# EAGLE design Breakout (EAGLE 9.4.2)
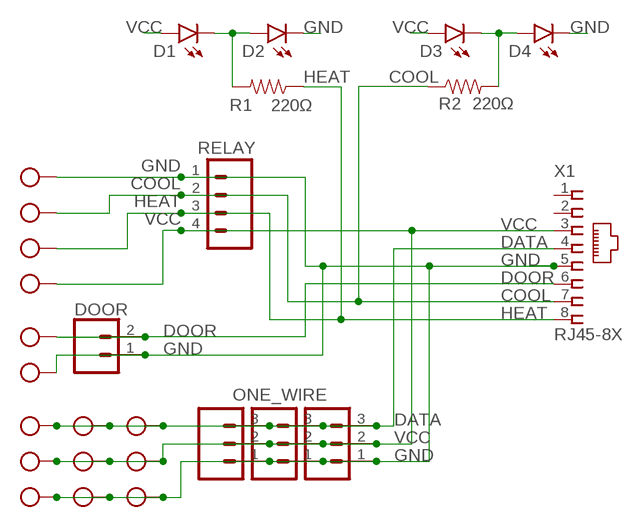
[diagram p0: schematic, sheet 1]

## Parts
D1  HINV  LED3MM  [LED_3MM]
D2  HNON  LED3MM  [LED_3MM]
D3  CINV  LED3MM  [LED_3MM]
D4  CNON  LED3MM  [LED_3MM]
DOOR  2-PIN  CONN_02  [1X02]
ONE_WIRE1  3-PIN  CONN_03  [1X03]
ONE_WIRE2  3-PIN  CONN_03  [1X03]
ONE_WIRE3  3-PIN  CONN_03  [1X03]
R1  220Ω  RESISTORAXIAL-0.3  [AXIAL-0.3]
R2  220Ω  RESISTORAXIAL-0.3  [AXIAL-0.3]
RELAY  4-PIN  CONN_04PTH  [1X04]
RELAY_TERM  4TERM  W237-4  [W237-4]
X1  RJ45-8X  [RJ45-NO-SHIELD]
X2  4TERM  W237-102  [W237-102]
X3  3TERM  W237-103  [W237-103]
X4  3TERM  W237-103  [W237-103]
X5  3TERM  W237-103  [W237-103]

## Nets
COOL: R2.P$1 RELAY.2 RELAY_TERM.2 X1.7
DATA: ONE_WIRE1.3 ONE_WIRE2.3 ONE_WIRE3.3 X1.4 X3.1 X4.1 X5.1
DOOR: DOOR.2 X1.6 X2.1
GND: D2.K(C) D4.K(C) DOOR.1 ONE_WIRE1.1 ONE_WIRE2.1 ONE_WIRE3.1 RELAY.1 RELAY_TERM.1 X1.5 X2.2 X3.3 X4.3 X5.3
HEAT: R1.P$1 RELAY.3 RELAY_TERM.3 X1.8
N$1: D1.K(C) D2.A R1.P$2
N$2: D3.K(C) D4.A R2.P$2
VCC: D1.A D3.A ONE_WIRE1.2 ONE_WIRE2.2 ONE_WIRE3.2 RELAY.4 RELAY_TERM.4 X1.3 X3.2 X4.2 X5.2
Unconnected: X1.1 X1.2

## Notes on the sheet
- ONE_WIRE

## Library data of the parts
D1-D4 = SparkFun-LED:LED: LED (Generic) Standard schematic elements and footprints for 5mm, 3mm, 1206, and 0603 sized LEDs. Generic LEDs with no color specified.; PROD_ID: DIO-08794
DOOR = SparkFun-Connectors:CONN_02: Multi connection point. Often used as Generic Header-pin footprint for 0.1 inch spaced/style header connections On any of the 0.1 inch spaced packages, you can populate with these: Break Away Headers - Straight <https://www.sparkfun.com/products/116> (PRT-00116) Break Away Male Headers - Right Angle <https://www.sparkfun.com/products/553> (PRT-00553) Female Headers <https://www.sparkfun.com/products/115> (PRT-00115) Break Away Headers - Machine Pin <https://www.sparkfun.com/products/117> (PRT-00117) Break Away Female Headers - Swiss Machine Pin <https://www.sparkfun.com/products/743> (PRT-00743) For SCREWTERMINALS and SPRING TERMINALS visit here: Screw Terimnals on SparkFun.com <https://www.sparkfun.com/search/results?term=Screw+Terminals> (5mm/3.5mm/2.54mm spacing) This device is also useful as a general connection point to wire up your design to another part of your project. Our various solder wires solder well into these plated through hole pads. Hook-Up Wire - Assortment (Stranded, 22 AWG) <https://www.sparkfun.com/products/11375> (PRT-11375) Hook-Up Wire - Assortment (Solid Core, 22 AWG) <https://www.sparkfun.com/products/11367> (PRT-11367) View the entire wire category on our website here <https://www.sparkfun.com/categories/141> Special notes: Molex polarized connector foot print use with: PRT-08233 with associated crimp pins and housings. 2.54_SCREWTERM for use with PRT-10571. 3.5mm Screw Terminal footprints for PRT-08084 5mm Screw Terminal footprints for use with PRT-08432
ONE_WIRE1-ONE_WIRE3 = SparkFun-Connectors:CONN_03: Multi connection point. Often used as Generic Header-pin footprint for 0.1 inch spaced/style header connections On any of the 0.1 inch spaced packages, you can populate with these: Break Away Headers - Straight <https://www.sparkfun.com/products/116> (PRT-00116) Break Away Male Headers - Right Angle <https://www.sparkfun.com/products/553> (PRT-00553) Female Headers <https://www.sparkfun.com/products/115> (PRT-00115) Break Away Headers - Machine Pin <https://www.sparkfun.com/products/117> (PRT-00117) Break Away Female Headers - Swiss Machine Pin <https://www.sparkfun.com/products/743> (PRT-00743) Stackable Header - 3 Pin (Female, 0.1") <https://www.sparkfun.com/products/13875> (PRT-13875) For SCREWTERMINALS and SPRING TERMINALS visit here: Screw Terimnals on SparkFun.com <https://www.sparkfun.com/search/results?term=Screw+Terminals> (5mm/3.5mm/2.54mm spacing) This device is also useful as a general connection point to wire up your design to another part of your project. Our various solder wires solder well into these plated through hole pads. Hook-Up Wire - Assortment (Stranded, 22 AWG) <https://www.sparkfun.com/products/11375> (PRT-11375) Hook-Up Wire - Assortment (Solid Core, 22 AWG) <https://www.sparkfun.com/products/11367> (PRT-11367) View the entire wire category on our website here <https://www.sparkfun.com/categories/141> Special notes: Molex polarized connector foot print use with SKU : PRT-08232 with associated crimp pins and housings.; PROD_ID: XXX-00000; VALUE: 455-1750-1-ND
R1 R2 = SparkFun-Passives:RESISTOR: Resistor Basic schematic elements and footprints for 0603, 1206, and PTH resistors.
RELAY = SparkFun-Connectors:CONN_04: Multi connection point. Often used as Generic Header-pin footprint for 0.1 inch spaced/style header connections On any of the 0.1 inch spaced packages, you can populate with these: Break Away Headers - Straight <https://www.sparkfun.com/products/116> (PRT-00116) Break Away Male Headers - Right Angle <https://www.sparkfun.com/products/553> (PRT-00553) Female Headers <https://www.sparkfun.com/products/115> (PRT-00115) Break Away Headers - Machine Pin <https://www.sparkfun.com/products/117> (PRT-00117) Break Away Female Headers - Swiss Machine Pin <https://www.sparkfun.com/products/743> (PRT-00743) For SCREWTERMINALS and SPRING TERMINALS visit here: Screw Terimnals on SparkFun.com <https://www.sparkfun.com/search/results?term=Screw+Terminals> (5mm/3.5mm/2.54mm spacing) This device is also useful as a general connection point to wire up your design to another part of your project. Our various solder wires solder well into these plated through hole pads. Hook-Up Wire - Assortment (Stranded, 22 AWG) <https://www.sparkfun.com/products/11375> (PRT-11375) Hook-Up Wire - Assortment (Solid Core, 22 AWG) <https://www.sparkfun.com/products/11367> (PRT-11367) View the entire wire category on our website here <https://www.sparkfun.com/categories/141> Special notes: Molex polarized connector foot print use with SKU : PRT-08231 with associated crimp pins and housings. 1MM SMD Version SKU: PRT-10208; PROD_ID: CONN-09696
RELAY_TERM = con-wago-500:W237-4: WAGO SCREW CLAMP; OC_FARNELL: unknown; OC_NEWARK: unknown
X1 = con-tycoelectronics:RJ45: CORCOM Modular RJ Jacks No Shield Source: www.tycoelectronics.com .. ENG_DS_1654001_1099_RJ_L_0507.pdf; MPN: RJ45-8X; OC_FARNELL: unknown; OC_NEWARK: 16R6101
X2 = con-wago-500:W237-102: WAGO SCREW CLAMP; MPN: 237-102; OC_FARNELL: unknown; OC_NEWARK: 70K9898
X3-X5 = con-wago-500:W237-103: WAGO SCREW CLAMP; MPN: 237-103; OC_FARNELL: unknown; OC_NEWARK: 18M7116

## Board
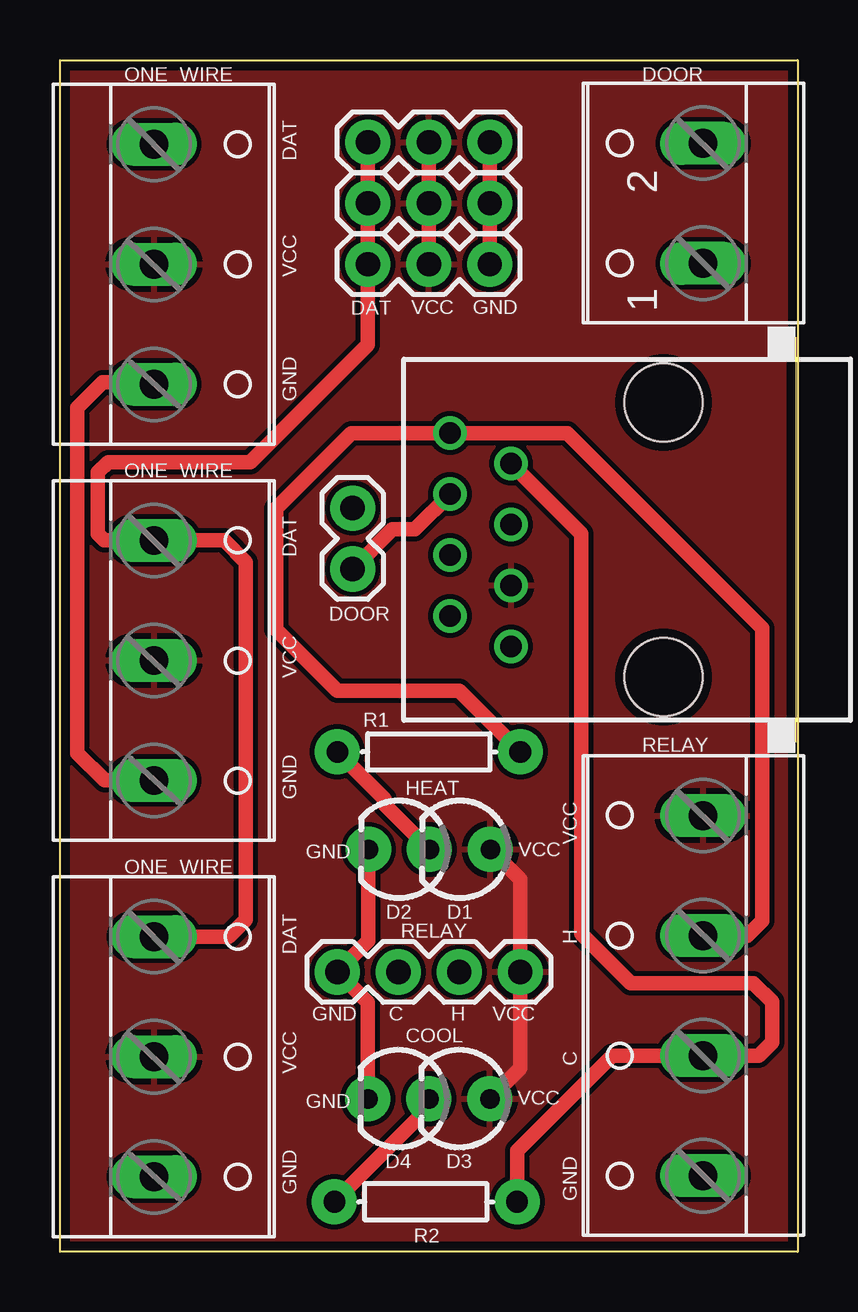
[diagram p1: board, top side]
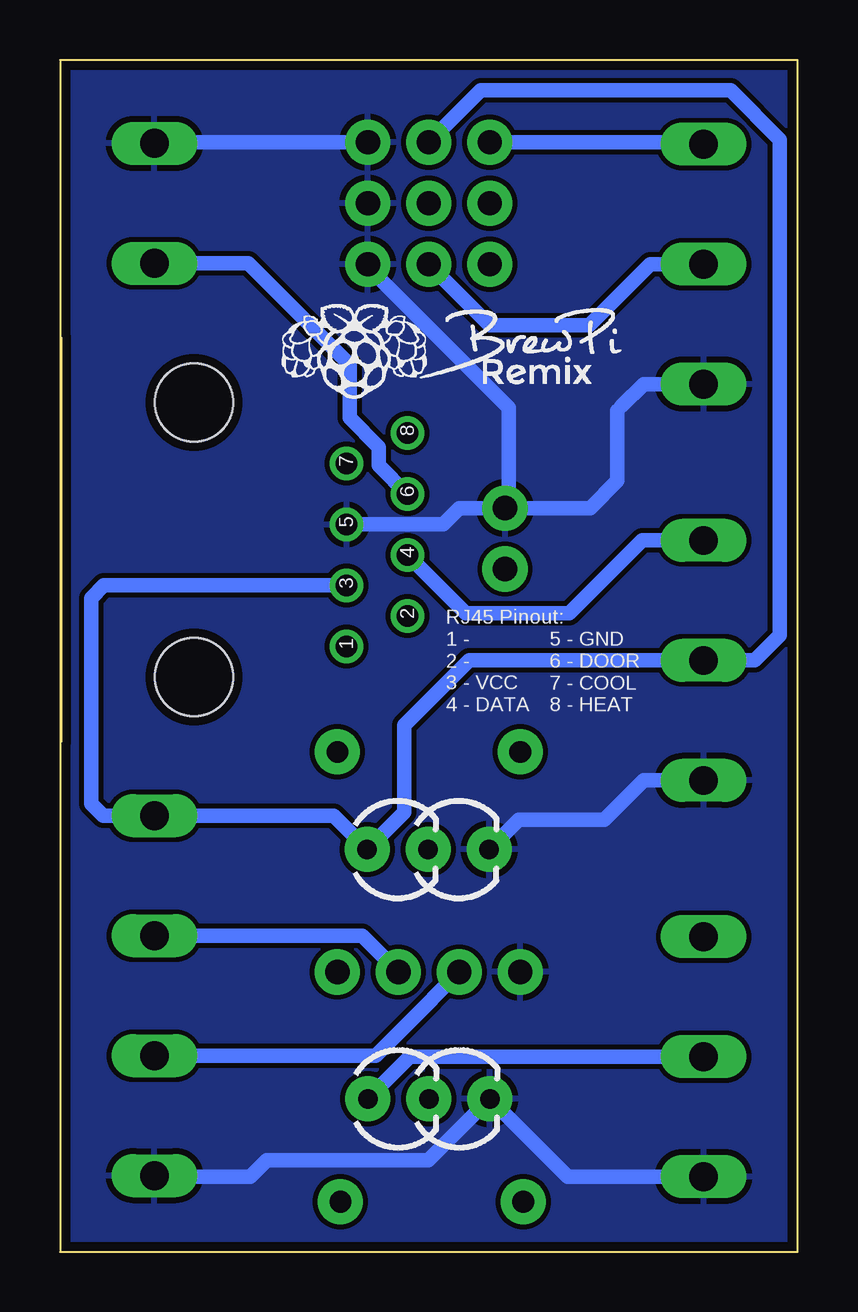
[diagram p2: board, bottom side, seen from below]

Size 30.73 x 49.66 mm. Coordinates in mm from the lower left corner, seen from the top.
Outline: 30.73,0 0,0 0,49.66 30.73,49.66 30.73,0
Copper layers (1*16): Top 0.035559375mm / dielectric 1.6mm / Bottom 0.035559375mm
Design rules "oshpark-2layer *": minimum track width 6mil, minimum drill 10mil, track to track 8mil, track to pad 8mil, pad to pad 8mil, via to via 8mil, smd to smd 8mil, copper to edge 15mil, drill to drill 6mil, minimum pad ring 5mil, minimum via ring 5mil, stop-mask expansion 2.5mil, vias tented up to drill 0mil, thermal gap 10mil

### Footprints (pad centres in the part's own frame; a part is rotated, then mirrored left to right if it is on the bottom)
LED_3MM = drill 0.813 pad 1.88: A -1.27,0; K 1.27,0
1X02 = drill 1.016 pad 1.88: 1 0,0; 2 2.54,0
1X03 = drill 1.016 pad 1.88: 1 0,0; 2 2.54,0; 3 5.08,0
AXIAL-0.3 = drill 0.9 pad 1.88: P$1 -3.81,0; P$2 3.81,0
1X04 = drill 1.016 pad 1.88: 1 0,0; 2 2.54,0; 3 5.08,0; 4 7.62,0
W237-4 = drill 1.194 long: 1 -7.5,-1.27; 2 -2.5,-1.27; 3 2.5,-1.27; 4 7.5,-1.27
RJ45-NO-SHIELD = drill 0.9 pad 1.4: 1 -4.445,6.35; 2 -3.175,8.89; 3 -1.905,6.35; 4 -0.635,8.89; 5 0.635,6.35; 6 1.905,8.89; 7 3.175,6.35; 8 4.445,8.89 | hole 3.251: -5.715,0; 5.715,0
W237-102 = drill 1.194 long: 1 -2.5,-1.27; 2 2.5,-1.27
W237-103 = drill 1.194 long: 1 -5,-1.29; 2 0,-1.29; 3 5,-1.29

### Placement (x,y rotation side)
D1  16.66,16.76 180 top
D2  14.12,16.76 180 top
D3  16.64,6.38 180 top
D4  14.1,6.38 180 top
DOOR  12.19,30.99 270 top
ONE_WIRE1  17.91,46.23 180 top
ONE_WIRE2  17.91,43.69 180 top
ONE_WIRE3  17.91,41.15 180 top
R1  15.37,20.83 180 top
R2  15.24,2.08 180 top
RELAY  11.56,11.66 0 top
RELAY_TERM  25.53,10.67 90 top
X1  25.15,29.67 90 top
X2  25.53,43.69 90 top
X3  5.21,41.15 270 top
X4  5.21,24.64 270 top
X5  5.21,8.13 270 top

### Tracks (layer width: path | path; a pad name or v marks a point on that pad's centre or on a via)
COOL
  Top 0.61: X1.7 21.72,29.92 21.72,13.25 23.79,11.19 28.89,11.19 29.67,10.41 29.67,8.72 29.11,8.17 RELAY_TERM.2 23,8.17 19.05,4.22 R2.P$1
  Bottom 0.61: RELAY.2 16.36,9.4 17.59,8.17 RELAY_TERM.2
DATA
  Top 0.61: ONE_WIRE1.3 ONE_WIRE2.3 ONE_WIRE3.3 12.83,37.8 8.59,33.56 7.93,32.9 2,32.9 1.57,32.47 1.57,29.91 1.85,29.64 X4.1 6.85,29.64 7.75,28.74 7.75,25.81 7.75,16.96 7.75,13.84 7.03,13.13 X5.1
  Bottom 0.61: X1.4 13.83,26.6 9.51,26.6 6.47,29.64 X4.1 | X3.1 4,46.23 ONE_WIRE1.3
DOOR
  Top 0.61: X1.6 14.79,30.1 13.85,30.1 DOOR.2
  Bottom 0.61: X1.6 17.45,32.76 17.45,33.52 18.67,34.75 18.67,36.96 22.9,41.19 X2.1
GND
  Top 0.61: ONE_WIRE3.1 ONE_WIRE2.1 ONE_WIRE1.1 | D2.K 12.85,12.95 RELAY.1 12.83,10.39 D4.K | X3.3 3.84,36.22 1.79,36.22 0.72,35.16 0.72,20.77 1.86,19.64 X4.3
  Bottom 0.61: ONE_WIRE3.1 17.91,41.04 12.03,35.17 12.03,31.15 DOOR.1 | ONE_WIRE1.1 26.76,46.23 X2.2 | DOOR.1 9.08,30.99 8.64,30.99 7.51,32.12 7.51,35.05 7.32,35.25 6.42,36.15 X3.3 | D2.K 11.63,17.99 8.06,17.99 6.41,19.64 X4.3 | DOOR.1 14.1,30.99 14.77,30.32 18.78,30.32 X1.5 | X5.3 9.58,3.13 D4.K 14.63,4.57 15.39,3.81 22.11,3.81 22.8,3.12 26.75,3.12 RELAY_TERM.1
  pour Bottom: -0.63,50.33 31.8,50.33 31.94,50.18 31.94,-0.42 31.62,-0.74 -0.7,-0.74 -0.83,-0.61 -0.83,50.18 -0.75,50.25
HEAT
  Top 0.61: RELAY_TERM.3 28.64,13.17 29.26,13.79 29.26,25.98 21.13,34.11 X1.8 12.14,34.11 9.02,30.99 9.02,25.91 11.56,23.37 16.64,23.37 R1.P$1
  Bottom 0.61: RELAY.3 18.15,13.17 RELAY_TERM.3
N$1
  Top 0.61: D2.A 13.53,18.63 13.53,18.85 R1.P$2
N$2
  Top 0.61: D4.A 15.37,6.02 R2.P$2
VCC
  Top 0.61: ONE_WIRE3.2 ONE_WIRE2.2 ONE_WIRE1.2 | D3.A 19.18,7.64 RELAY.4 19.18,15.52 D1.A
  Bottom 0.61: D3.A 16.15,8.13 X5.2 | ONE_WIRE3.2 12.83,38.61 8.69,38.61 6.15,41.15 X3.2 | ONE_WIRE1.2 13.21,48.39 2.79,48.39 0.74,46.33 0.74,25.68 1.78,24.64 X4.2 13.68,24.64 16.39,21.93 16.39,18.31 D1.A 19.34,18.17 RELAY_TERM.4 28.93,18.17 29.44,18.68 29.44,27.23 28.9,27.76 X1.3
  pour Top: -0.7,50.45 -0.7,-0.56 -0.83,-0.69 31.69,-0.69 31.82,-0.81 31.82,50 31.69,50.13 31.45,50.38

### Text on the board
tNames: ONE_WIRE | DOOR | DAT | VCC | DAT | VCC | GND | GND | ONE_WIRE | DAT | DOOR | VCC | RELAY | GND | HEAT | VCC | GND | VCC | ONE_WIRE | H | DAT | GND | C | H | VCC | COOL | C | VCC | VCC | GND | GND | GND
bNames: 8 | 7 | 6 | 5 | 4 | 3 | 2 | 1 | 5 - GND / 6 - DOOR / 7 - COOL / 8 - HEAT | RJ45 Pinout: / 1 - / 2 - / 3 - VCC / 4 - DATA